# Altium schematic sheet POWERchDoc.SchDoc: POWER
size 420 x 297 mm; SheetNumber: 5; SheetTotal: 12
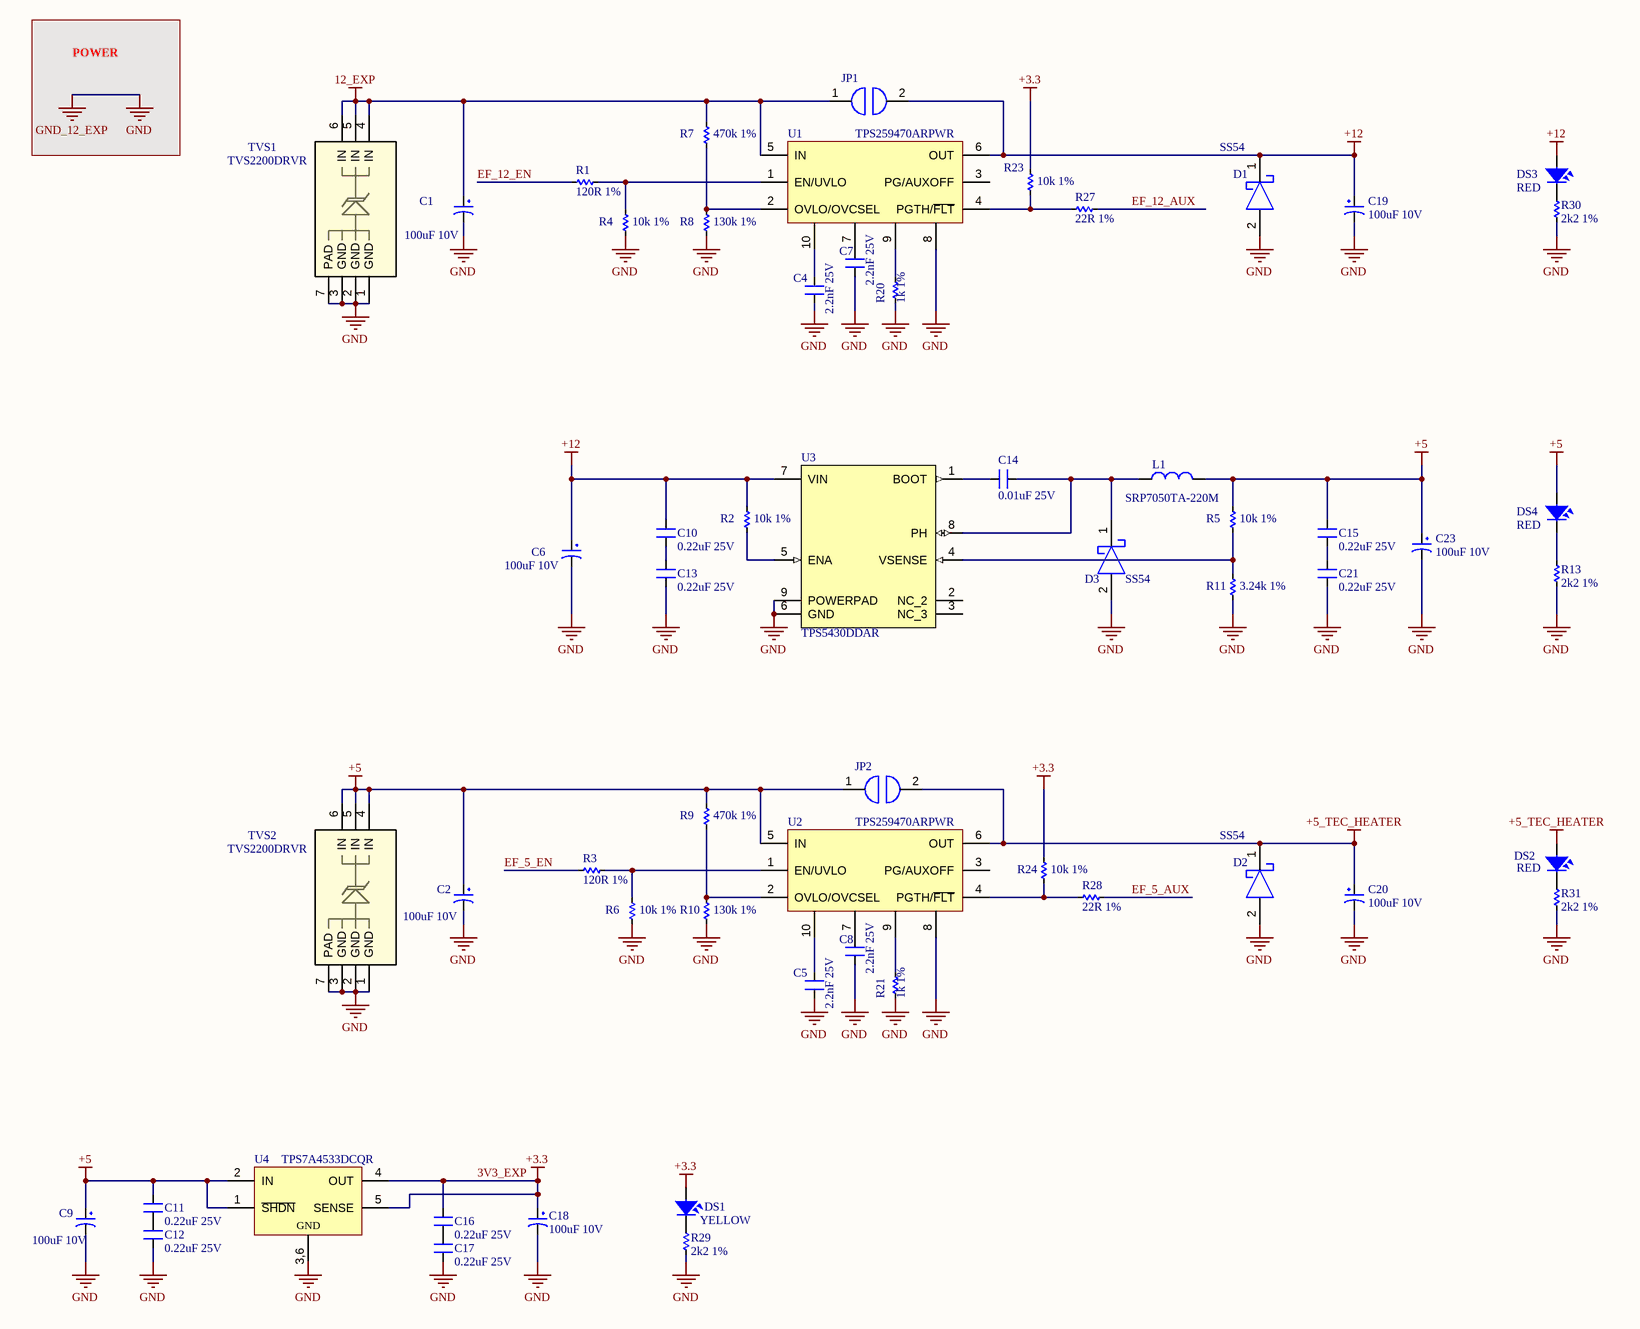
[diagram p0: POWERchDoc.SchDoc]

## Parts
C1  100uF 10V  [TANTALUM-SMD-1206-EXP-V101]
C2  100uF 10V  [TANTALUM-SMD-1206-EXP-V101]
C4  2.2nF 25V  [CN-SMD-0603-EXP-V101]
C5  2.2nF 25V  [CN-SMD-0603-EXP-V101]
C6  100uF 10V  [TANTALUM-SMD-1206-EXP-V101]
C7  2.2nF 25V  [CN-SMD-0603-EXP-V101]
C8  2.2nF 25V  [CN-SMD-0603-EXP-V101]
C9  100uF 10V  [TANTALUM-SMD-1206-EXP-V101]
C10  0.22uF 25V  [CN-SMD-0603-EXP-V101]
C11  0.22uF 25V  [CN-SMD-0603-EXP-V101]
C12  0.22uF 25V  [CN-SMD-0603-EXP-V101]
C13  0.22uF 25V  [CN-SMD-0603-EXP-V101]
C14  0.01uF 25V  [CN-SMD-0603-EXP-V101]
C15  0.22uF 25V  [CN-SMD-0603-EXP-V101]
C16  0.22uF 25V  [CN-SMD-0603-EXP-V101]
C17  0.22uF 25V  [CN-SMD-0603-EXP-V101]
C18  100uF 10V  [TANTALUM-SMD-1206-EXP-V101]
C19  100uF 10V  [TANTALUM-SMD-1206-EXP-V101]
C20  100uF 10V  [TANTALUM-SMD-1206-EXP-V101]
C21  0.22uF 25V  [CN-SMD-0603-EXP-V101]
C23  100uF 10V  [TANTALUM-SMD-1206-EXP-V101]
D1  SS54  [DO214-AC-SMA]
D2  SS54  [DO214-AC-SMA]
D3  SS54  [DO214-AC-SMA]
DS1  YELLOW  [LED-0603-BLUE-EXP-V01]
DS2  RED  [LED-0603-BLUE-EXP-V01]
DS3  RED  [LED-0603-BLUE-EXP-V01]
DS4  RED  [LED-0603-BLUE-EXP-V01]
JP1  jumper2  [JUMPER-EXP-V101]  (value not drawn)
JP2  jumper2  [JUMPER-EXP-V101]  (value not drawn)
L1  SRP7050TA-220M  [PSM6050]
R1  120R 1%  [RES-SMD-0603-EXP-V101]
R2  10k 1%  [RES-SMD-0603-EXP-V101]
R3  120R 1%  [RES-SMD-0603-EXP-V101]
R4  10k 1%  [RES-SMD-0603-EXP-V101]
R5  10k 1%  [RES-SMD-0603-EXP-V101]
R6  10k 1%  [RES-SMD-0603-EXP-V101]
R7  470k 1%  [RES-SMD-0603-EXP-V101]
R8  130k 1%  [RES-SMD-0603-EXP-V101]
R9  470k 1%  [RES-SMD-0603-EXP-V101]
R10  130k 1%  [RES-SMD-0603-EXP-V101]
R11  3.24k 1%  [RES-SMD-0603-EXP-V101]
R13  2k2 1%  [RES-SMD-0603-EXP-V101]
R20  1k 1%  [RES-SMD-0603-EXP-V101]
R21  1k 1%  [RES-SMD-0603-EXP-V101]
R23  10k 1%  [RES-SMD-0603-EXP-V101]
R24  10k 1%  [RES-SMD-0603-EXP-V101]
R27  22R 1%  [RES-SMD-0603-EXP-V101]
R28  22R 1%  [RES-SMD-0603-EXP-V101]
R29  2k2 1%  [RES-SMD-0603-EXP-V101]
R30  2k2 1%  [RES-SMD-0603-EXP-V101]
R31  2k2 1%  [RES-SMD-0603-EXP-V101]
TVS1  TVS2200DRVR  [TVS2200]
TVS2  TVS2200DRVR  [TVS2200]
U1  TPS259470ARPWR  [VQFN-HR-10-EXP-V101]
U2  TPS259470ARPWR  [VQFN-HR-10-EXP-V101]
U3  TPS5430DDAR  [TPS5430DDAR]
U4  TPS7A4533DCQR  [SOT223_6]

## Nets
3V3_EXP: C16.2 C18.1 DS1.1 R23.1 R24.1 U4.4(OUT) U4.5(SENSE)  [also labelled +3.3]
12_EXP: C1.1 JP1.1 R7.1 TVS1.4(IN) TVS1.5(IN) TVS1.6(IN) U1.5(IN)
+5: C2.1 C9.1 C11.2 C15.2 C23.1 DS4.1 JP2.1 L1.2 R5.1 R9.1 TVS2.4(IN) TVS2.5(IN) TVS2.6(IN) U2.5(IN) U4.1(~{SHDN}) U4.2(IN)
+5_TEC_HEATER: C20.1 D2.1 DS2.1 JP2.2 U2.6(OUT)
+12: C6.1 C10.2 C19.1 D1.1 DS3.1 JP1.2 R2.1 U1.6(OUT) U3.7(VIN)
GND: C1.2 C2.2 C4.1 C5.1 C6.2 C7.1 C8.1 C9.2 C12.1 C13.1 C17.1 C18.2 C19.2 C20.2 C21.1 C23.2 D1.2 D2.2 D3.2 R4.2 R6.2 R8.2 R10.2 R11.2 R13.2 R20.2 R21.2 R29.2 R30.2 R31.2 TVS1.1(GND) TVS1.2(GND) TVS1.3(GND) TVS1.7(PAD) TVS2.1(GND) TVS2.2(GND) TVS2.3(GND) TVS2.7(PAD) U1.8 U2.8 U3.6(GND) U3.9(POWERPAD) U4.3,6(GND)  [also labelled GND_12_EXP]
EF_5_AUX: R28.2
EF_5_EN: R3.1
EF_12_AUX: R27.2
EF_12_EN: R1.1
NetC4_2: C4.2 U1.10
NetC5_2: C5.2 U2.10
NetC7_2: C7.2 U1.7
NetC8_2: C8.2 U2.7
NetC10_1: C10.1 C13.2
NetC11_1: C11.1 C12.2
NetC14_1: C14.1 D3.1 L1.1 U3.8(PH)
NetC14_2: C14.2 U3.1(BOOT)
NetC15_1: C15.1 C21.2
NetC16_1: C16.1 C17.2
NetDS1_2: DS1.2 R29.1
NetDS2_2: DS2.2 R31.1
NetDS3_2: DS3.2 R30.1
NetDS4_2: DS4.2 R13.1
NetR1_2: R1.2 R4.1 U1.1(EN/UVLO)
NetR2_2: R2.2 U3.5(ENA)
NetR3_2: R3.2 R6.1 U2.1(EN/UVLO)
NetR5_2: R5.2 R11.1 U3.4(VSENSE)
NetR7_2: R7.2 R8.1 U1.2(OVLO/OVCSEL)
NetR9_2: R9.2 R10.1 U2.2(OVLO/OVCSEL)
NetR20_1: R20.1 U1.9
NetR21_1: R21.1 U2.9
NetR23_2: R23.2 R27.1 U1.4(PGTH/~{FLT})
NetR24_2: R24.2 R28.1 U2.4(PGTH/~{FLT})

Not connected (* = marked no-connect by the designer): U1 3(PG/AUXOFF); U2 3(PG/AUXOFF); U3 2(NC_2) 3(NC_3)

## Notes on the sheet
- POWER
- Project:
- PEE-PC1
- Sub-system:
- NANORACK_EXP_CONTROLLER
- Design by:
- SANG HUYNH
- BAO BUI Q.
- Sheet title:
- Sheet
- A3
- of
- Checked by:
- Approved by:
- VU PHAM
- Revision:
- Document No:
- V1.0.0
- Size:
- Date:

## Library data of the parts
C1 C2 C6 C9 C18-C20 C23 = Cap_Tantalum SMD: SMD; Chung_Loai: Dán; Don_Vi: Con; So_Chan: 2; Ten_Linh_Kien: Tụ tantalum 477A-470uF 10V SMD7343; Ma_Hang: MH001956; Kieu_Chan: *
C4 C5 C7 C8 C10-C17 C21 = Capacitors: Value: 33pF
D1-D3 = B360B-E3/52T: DIODE SCHOTTKY 40V 5A SMA
DS1-DS4 = LED SMD: Value: LED 3 - 5 ly 2 Colour
JP1 JP2 = JUMPER
L1 = SRP7050TA-220M: FIXED IND 22UH 2.5A 170 MOHM SMD
R1-R11 R13 R20 R21 R23 R24 R27-R31 = Res SMD: SMD; Manufacturer: Generic Components; Class: Passive; Published: 08/06/2000; Publisher: Altium Hobart Technology Centre
TVS1 TVS2 = TVS2200: UNIDIR PRECISION SURGE DIODE
U3 = TPS5430: IC REG BUCK ADJ 3A 8SOPWR
U4 = TPS7A4533DCQR: IC REG LINEAR 3.3V 1.5A SOT223-6